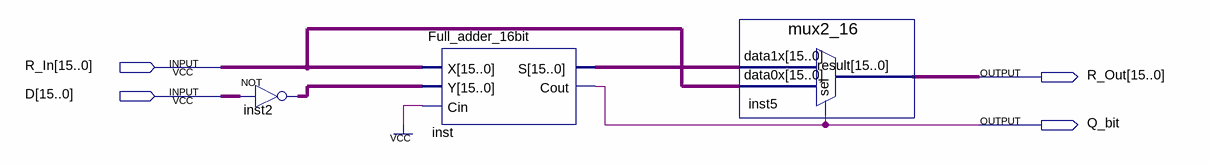
[diagram p0: schematic sheet]
// Quartus schematic Div_Step.bdf as structural Verilog: 3 symbols, 4 pins
module Div_Step (
  input  [15:0] R_In,
  input  [15:0] D,
  output [15:0] R_Out,
  output Q_bit
);

  wire [15:0] inst2_out, inst_s;

  assign inst2_out = ~D;  // NOT inst2, 16 bits wide
  Full_adder_16bit inst (.X(R_In), .Y(inst2_out), .Cin(1'b1), .S(inst_s), .Cout(Q_bit));
  mux2_16 inst5 (.data1x(inst_s), .data0x(R_In), .sel(Q_bit), .result(R_Out));
endmodule
